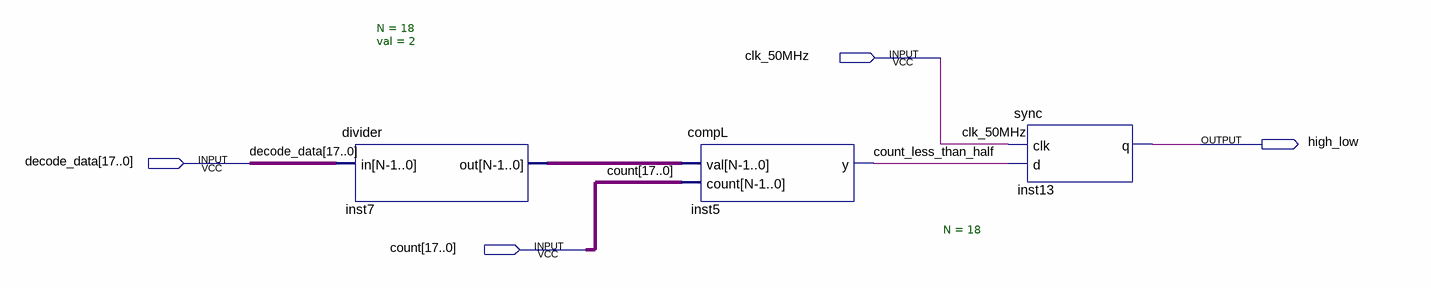
[diagram p0: schematic sheet]
// Quartus schematic oscillator.bdf as structural Verilog: 3 symbols, 4 pins
module oscillator (
  input  clk_50MHz,
  input  [17:0] decode_data,
  input  [17:0] count,
  output high_low
);

  wire count_less_than_half;
  wire [17:0] inst7_out;

  divider #(.N(18), .val(2)) inst7 (.in(decode_data), .out(inst7_out));
  compL #(.N(18)) inst5 (.val(inst7_out), .count(count), .y(count_less_than_half));
  sync inst13 (.clk(clk_50MHz), .d(count_less_than_half), .q(high_low));
endmodule
